# EasyEDA schematic CircuitDiagram.json
TITLE: Beer Fridge Setup; REV: 1.0; Date: 2019-05-20; Sheet: 1/1; Drawn By: Lennart Schoch; Company: -
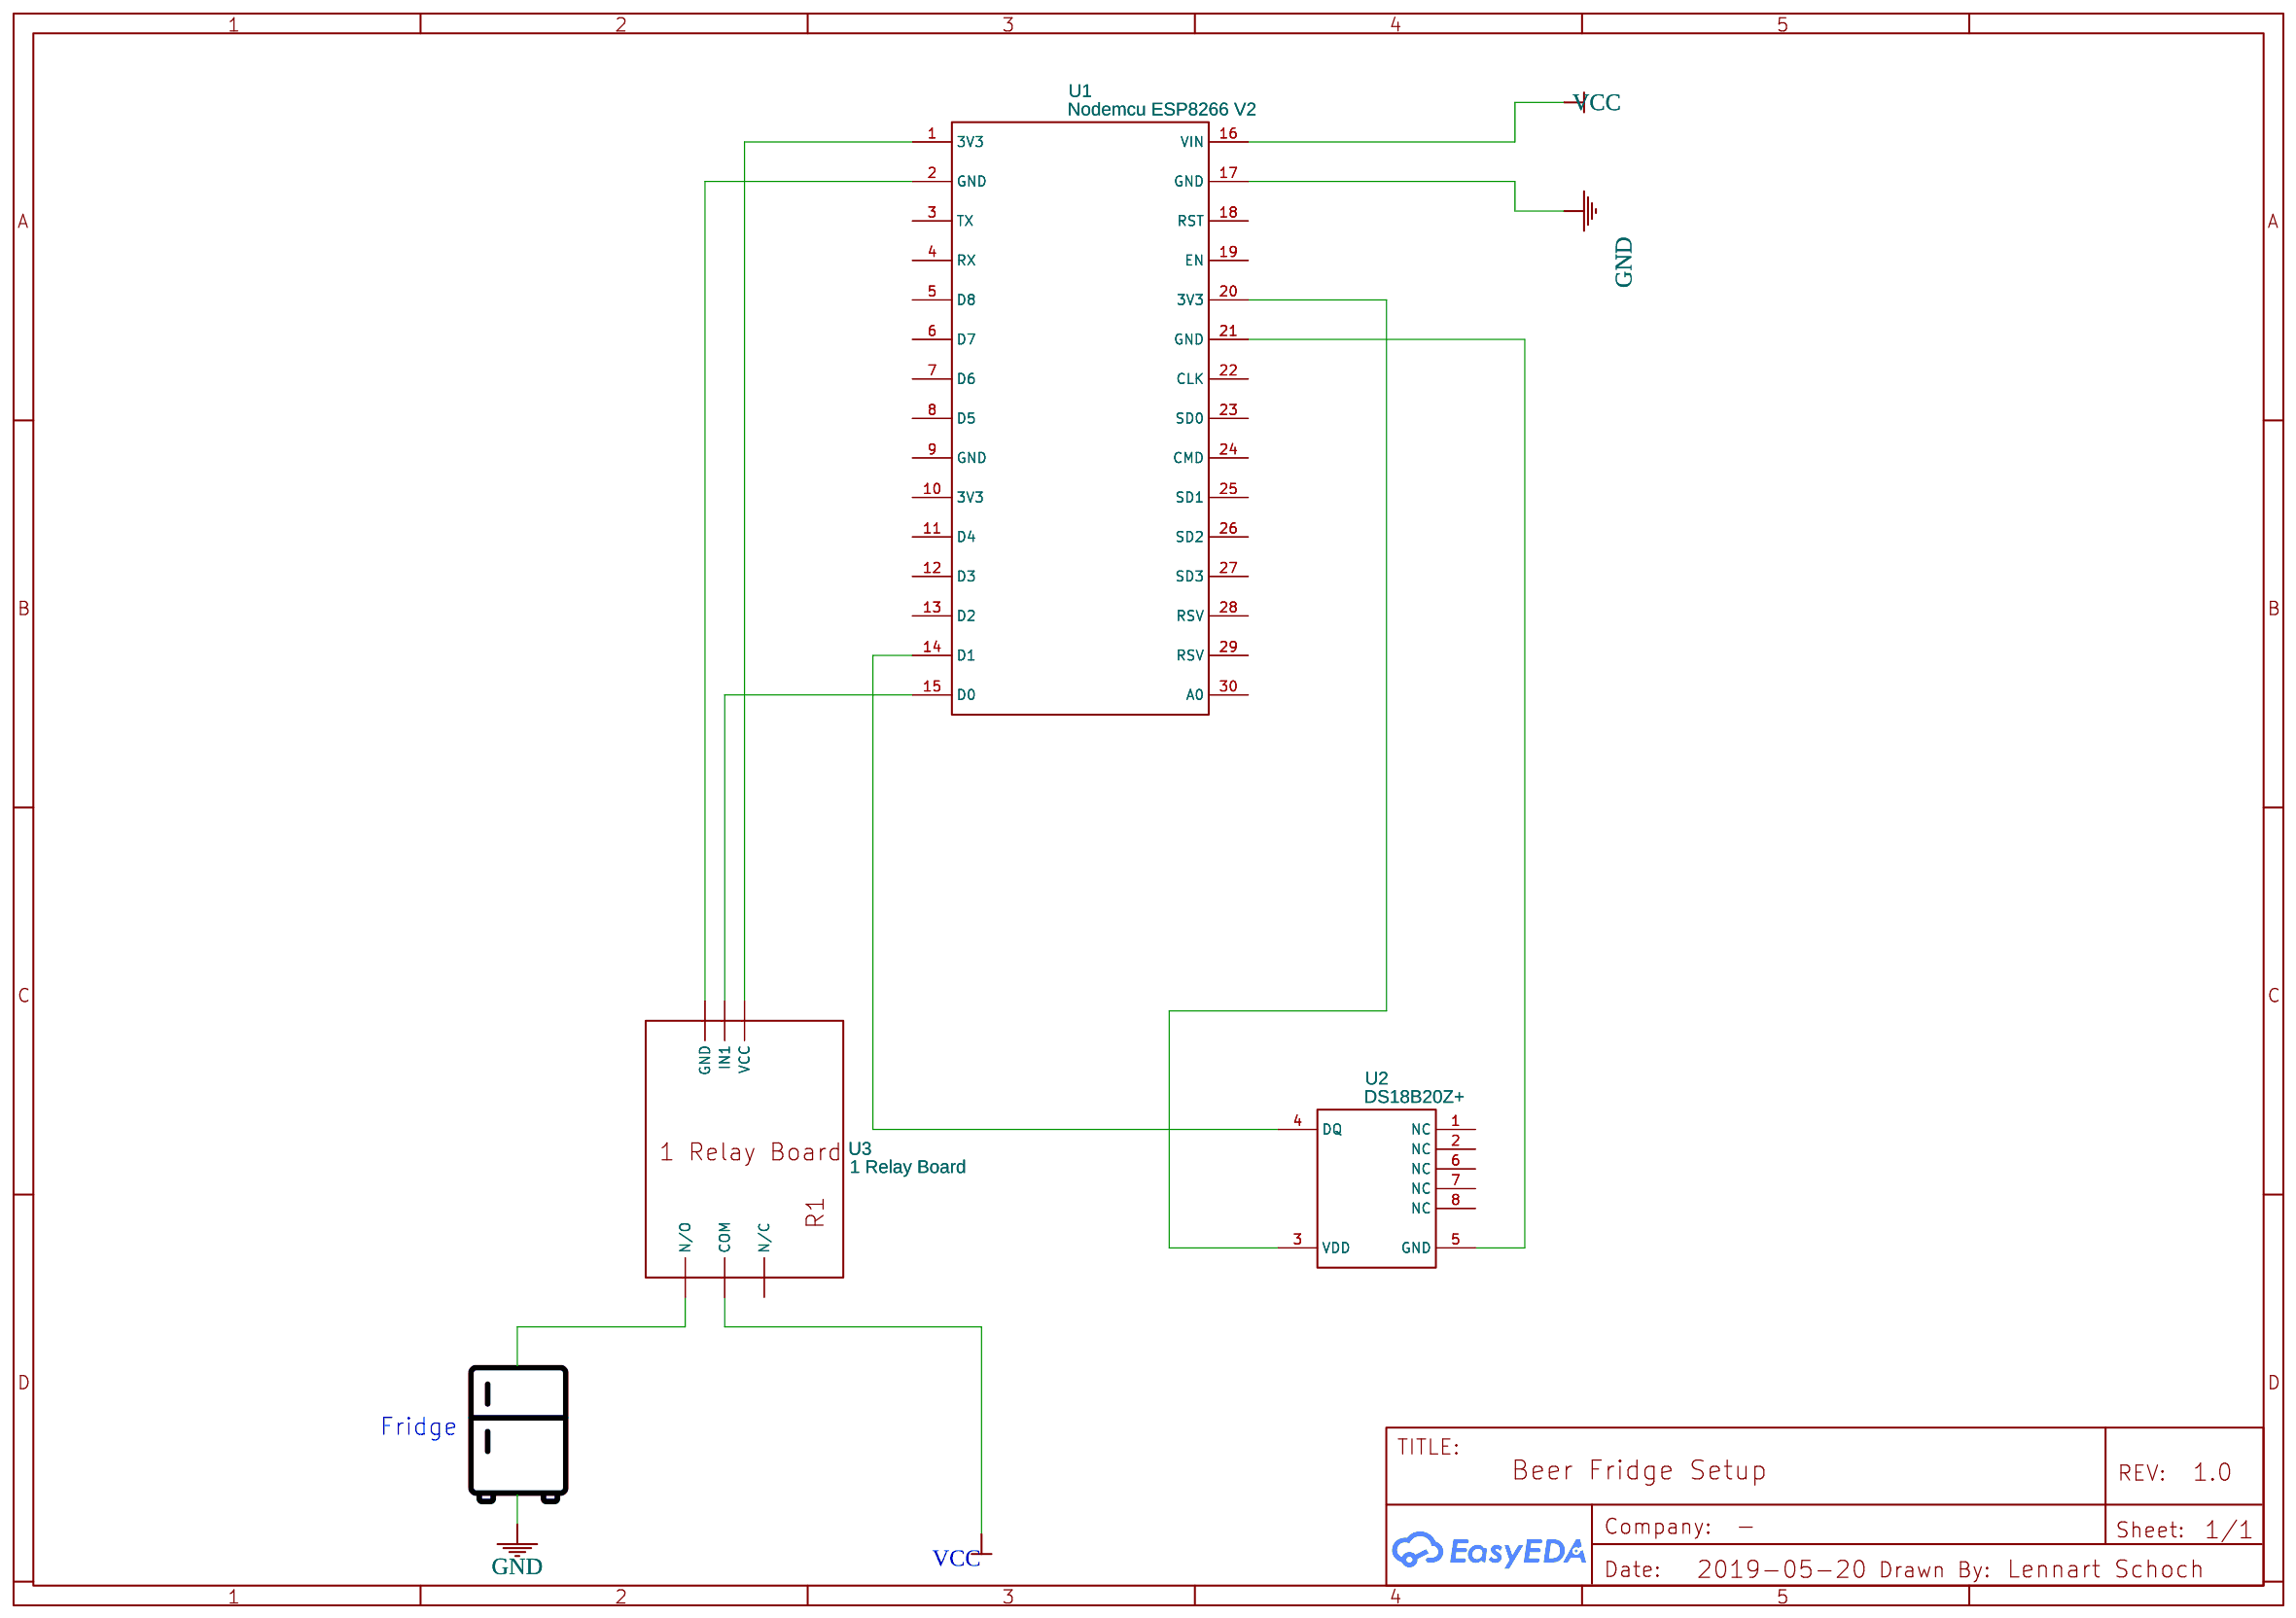
[diagram p0: schematic sheet]

## Parts
U1  Nodemcu ESP8266 V2  [NODEMCU ESP8266 V2]
U2  DS18B20Z+  [MAXM-S8+2_N]
U3  1 Relay Board  [DIP]

## Library data of the parts
U1 = -: Contributor: prabhat kasera
U2 = -: High-Precision 1-Wire Digital Thermometer, -55 to 125 degC, 8-Pin SOIC (S8+2), Pb-Free; Manufacturer Part: ?
U3 = -: Contributor: dvincent; sourceId: I81Vd71jB; Manufacturer Part: ?

## Nets
GND: U1.17(GND)
VCC: U1.16(VIN) U3.2(COM)
Net-(U1-1): U1.1(3V3) U1.15(D0) U3.5(VCC)
Net-(U1-2): U1.2(GND) U3.4(GND)
Net-(U1-14): U1.14(D1) U2.4(DQ)
Net-(U1-20): U1.20(3V3) U2.3(VDD)
Net-(U1-21): U1.21(GND) U2.5(GND)

Not connected (* = marked no-connect by the designer): U1 3(TX) 4(RX) 5(D8) 6(D7) 7(D6) 8(D5) 9(GND) 10(3V3) 11(D4) 12(D3) 13(D2) 18(RST) 19(EN) 22(CLK) 23(SD0) 24(CMD) 25(SD1) 26(SD2) 27(SD3) 28(RSV) 29(RSV) 30(A0); U2 1(NC) 2(NC) 6(NC) 7(NC) 8(NC); U3 1(N/C) 3(N/O)

## Notes on the sheet
- Fridge
